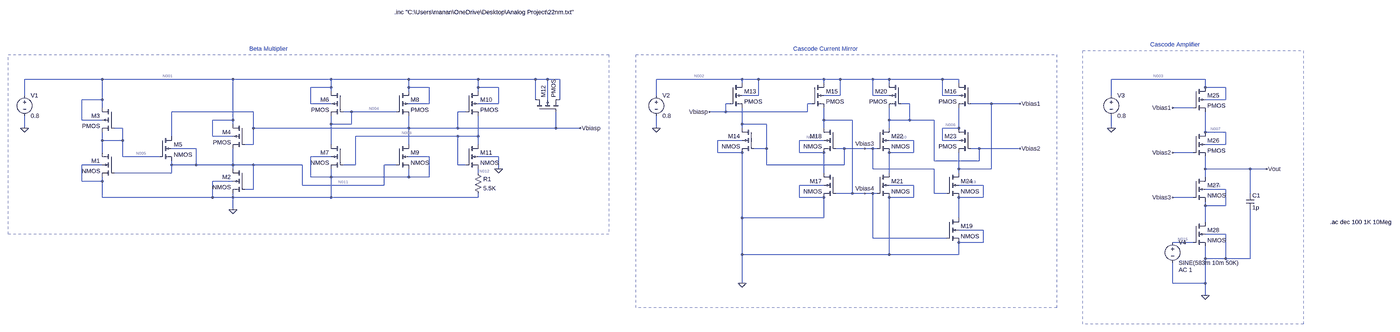
[diagram p0: schematic schematic 22nm.asc, whole sheet]
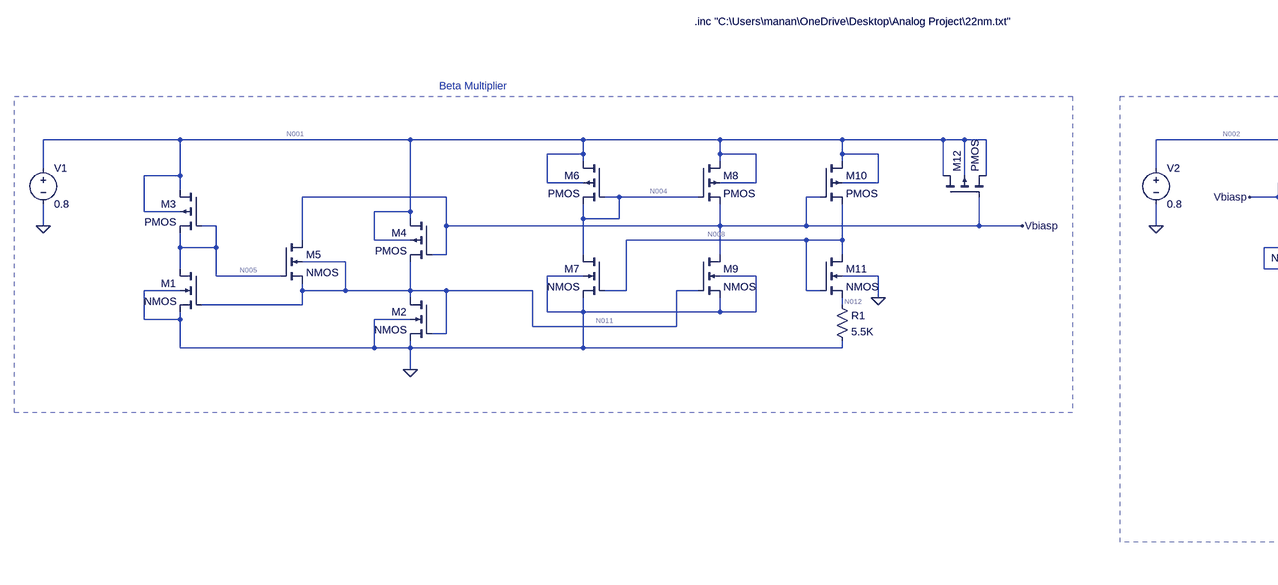
[diagram p1: schematic schematic 22nm.asc, part, row 1 of 1, column 1 of 2]
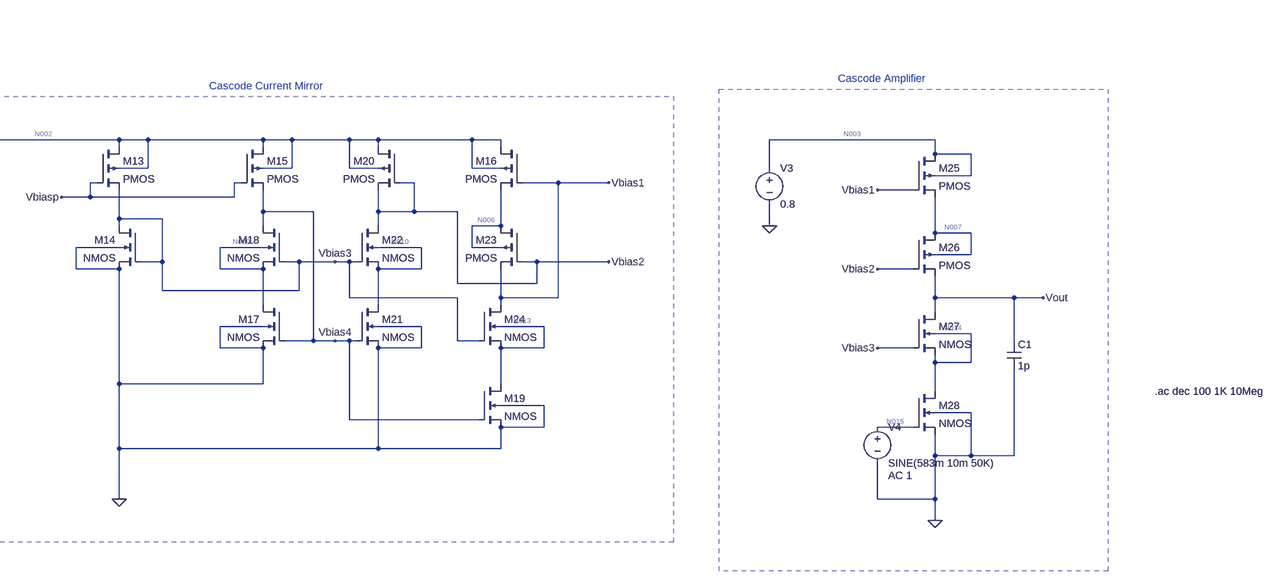
[diagram p2: schematic schematic 22nm.asc, part, row 1 of 1, column 2 of 2]
schematic 22nm.asc, the LTspice schematic file:
Version 4
SHEET 1 2888 964
WIRE -2528 0 -2832 0
WIRE -2016 0 -2528 0
WIRE -1632 0 -2016 0
WIRE -1328 0 -1632 0
WIRE -1056 0 -1328 0
WIRE -832 0 -1056 0
WIRE -784 0 -832 0
WIRE -736 0 -784 0
WIRE 224 0 -112 0
WIRE 288 0 224 0
WIRE 544 0 288 0
WIRE 608 0 544 0
WIRE 736 0 608 0
WIRE 800 0 736 0
WIRE 1008 0 800 0
WIRE 1072 0 1008 0
WIRE 2144 0 1776 0
WIRE 224 16 224 0
WIRE 544 16 544 0
WIRE 800 16 800 0
WIRE 1072 16 1072 0
WIRE -1632 32 -1632 0
WIRE -1632 32 -1712 32
WIRE -1328 32 -1328 0
WIRE -1248 32 -1328 32
WIRE -1056 32 -1056 0
WIRE -976 32 -1056 32
WIRE 2144 32 2144 0
WIRE 2224 32 2144 32
WIRE -1632 48 -1632 32
WIRE -1328 48 -1328 32
WIRE -1056 48 -1056 32
WIRE -2832 64 -2832 0
WIRE -112 64 -112 0
WIRE 288 64 288 0
WIRE 288 64 224 64
WIRE 608 64 608 0
WIRE 608 64 544 64
WIRE 736 64 736 0
WIRE 800 64 736 64
WIRE 1008 64 1008 0
WIRE 1072 64 1008 64
WIRE 1776 64 1776 0
WIRE -2528 80 -2528 0
WIRE -2528 80 -2608 80
WIRE -832 80 -832 0
WIRE -784 80 -784 0
WIRE -736 80 -736 0
WIRE 2224 80 2224 32
WIRE 2224 80 2144 80
WIRE -1712 96 -1712 32
WIRE -1632 96 -1712 96
WIRE -1248 96 -1248 32
WIRE -1248 96 -1328 96
WIRE -976 96 -976 32
WIRE -976 96 -1056 96
WIRE 176 96 160 96
WIRE 496 96 480 96
WIRE 880 96 848 96
WIRE 1200 96 1120 96
WIRE 1312 96 1200 96
WIRE -2528 112 -2528 80
WIRE 2096 112 2016 112
WIRE -1936 128 -2256 128
WIRE -1552 128 -1584 128
WIRE -1376 128 -1552 128
WIRE -1104 128 -1136 128
WIRE 160 128 160 96
WIRE 160 128 96 128
WIRE 480 128 480 96
WIRE 480 128 160 128
WIRE -2608 160 -2608 80
WIRE -2528 160 -2608 160
WIRE -2016 160 -2016 0
WIRE -2016 160 -2096 160
WIRE 544 160 544 112
WIRE 656 160 544 160
WIRE 800 160 800 112
WIRE 880 160 880 96
WIRE 880 160 800 160
WIRE 976 160 880 160
WIRE -2016 176 -2016 160
WIRE -1632 176 -1632 144
WIRE -1552 176 -1552 128
WIRE -1552 176 -1632 176
WIRE 224 176 224 112
WIRE 320 176 224 176
WIRE -2832 192 -2832 144
WIRE -2448 192 -2480 192
WIRE -1936 192 -1936 128
WIRE -1328 192 -1328 144
WIRE -1328 192 -1936 192
WIRE -1136 192 -1136 128
WIRE -1136 192 -1328 192
WIRE -752 192 -752 128
WIRE -752 192 -1136 192
WIRE -656 192 -752 192
WIRE -112 192 -112 144
WIRE 224 192 224 176
WIRE 544 192 544 160
WIRE 800 192 800 160
WIRE 1072 192 1072 112
WIRE 1072 192 1008 192
WIRE 1776 192 1776 144
WIRE 2144 208 2144 128
WIRE 2224 208 2144 208
WIRE -2256 224 -2256 128
WIRE -2096 224 -2096 160
WIRE -2016 224 -2096 224
WIRE -1136 224 -1536 224
WIRE -1056 224 -1056 144
WIRE -1056 224 -1136 224
WIRE -2528 240 -2528 208
WIRE -2448 240 -2448 192
WIRE -2448 240 -2528 240
WIRE 224 240 128 240
WIRE 544 240 448 240
WIRE 896 240 800 240
WIRE 1008 240 1008 192
WIRE 1072 240 1008 240
WIRE -1936 256 -1936 192
WIRE -1936 256 -1968 256
WIRE -1632 256 -1632 176
WIRE -1328 256 -1328 192
WIRE -1056 256 -1056 224
WIRE 2224 256 2224 208
WIRE 2224 256 2144 256
WIRE -2160 272 -2256 272
WIRE 320 272 320 176
WIRE 320 272 272 272
WIRE 624 272 592 272
WIRE 704 272 624 272
WIRE 736 272 704 272
WIRE 752 272 736 272
WIRE 1152 272 1120 272
WIRE 1312 272 1152 272
WIRE -2528 288 -2528 240
WIRE 128 288 128 240
WIRE 224 288 128 288
WIRE 448 288 448 240
WIRE 544 288 448 288
WIRE 896 288 896 240
WIRE 896 288 800 288
WIRE 2096 288 2016 288
WIRE -2448 304 -2448 240
WIRE -2304 304 -2448 304
WIRE -1632 304 -1712 304
WIRE -1248 304 -1328 304
WIRE -976 304 -1056 304
WIRE 976 320 976 160
WIRE 1152 320 1152 272
WIRE 1152 320 976 320
WIRE -2528 336 -2608 336
WIRE -2256 336 -2256 320
WIRE -2160 336 -2160 272
WIRE -2160 336 -2256 336
WIRE -2016 336 -2016 272
WIRE -2016 336 -2160 336
WIRE -1936 336 -2016 336
WIRE -1744 336 -1936 336
WIRE -1536 336 -1536 224
WIRE -1536 336 -1584 336
WIRE -1376 336 -1424 336
WIRE -1136 336 -1136 224
WIRE -1104 336 -1136 336
WIRE 320 336 320 272
WIRE 624 336 624 272
WIRE 624 336 320 336
WIRE -2016 352 -2016 336
WIRE -976 352 -976 304
WIRE 736 352 736 272
WIRE 976 352 736 352
WIRE 1072 352 1072 288
WIRE 1200 352 1200 96
WIRE 1200 352 1072 352
WIRE 2144 352 2144 304
WIRE 2320 352 2144 352
WIRE 2384 352 2320 352
WIRE -2256 368 -2256 336
WIRE -2256 368 -2480 368
WIRE -1056 368 -1056 352
WIRE 544 368 544 288
WIRE 800 368 800 288
WIRE 1072 368 1072 352
WIRE -1712 384 -1712 304
WIRE -1632 384 -1632 352
WIRE -1632 384 -1712 384
WIRE -1328 384 -1328 352
WIRE -1328 384 -1632 384
WIRE -1248 384 -1248 304
WIRE -1248 384 -1328 384
WIRE 2144 384 2144 352
WIRE -2608 400 -2608 336
WIRE -2528 400 -2528 384
WIRE -2528 400 -2608 400
WIRE -2016 400 -2096 400
WIRE -1744 416 -1744 336
WIRE -1424 416 -1424 336
WIRE -1424 416 -1744 416
WIRE 544 416 448 416
WIRE 896 416 800 416
WIRE 1168 416 1072 416
WIRE -1936 432 -1936 336
WIRE -1936 432 -1968 432
WIRE 2224 432 2144 432
WIRE 656 448 656 160
WIRE 656 448 592 448
WIRE 704 448 656 448
WIRE 736 448 704 448
WIRE 752 448 736 448
WIRE 976 448 976 352
WIRE 1024 448 976 448
WIRE 2320 448 2320 352
WIRE -2528 464 -2528 400
WIRE -2096 464 -2096 400
WIRE -2096 464 -2528 464
WIRE -2016 464 -2016 448
WIRE -2016 464 -2096 464
WIRE -1632 464 -1632 384
WIRE -1632 464 -2016 464
WIRE -1056 464 -1056 448
WIRE -1056 464 -1632 464
WIRE 448 464 448 416
WIRE 544 464 448 464
WIRE 896 464 896 416
WIRE 896 464 800 464
WIRE 1168 464 1168 416
WIRE 1168 464 1072 464
WIRE 2096 464 2016 464
WIRE 2144 496 2144 480
WIRE 2224 496 2224 432
WIRE 2224 496 2144 496
WIRE -2016 512 -2016 464
WIRE 224 544 224 288
WIRE 544 544 544 464
WIRE 544 544 224 544
WIRE 1072 544 1072 464
WIRE 2144 560 2144 496
WIRE 1168 592 1072 592
WIRE 2224 608 2144 608
WIRE 736 624 736 448
WIRE 1024 624 736 624
WIRE 1168 640 1168 592
WIRE 1168 640 1072 640
WIRE 2096 640 2016 640
WIRE 224 688 224 544
WIRE 800 688 800 464
WIRE 800 688 224 688
WIRE 1072 688 1072 640
WIRE 1072 688 800 688
WIRE 2144 704 2144 656
WIRE 2224 704 2224 608
WIRE 2224 704 2144 704
WIRE 2320 704 2320 512
WIRE 2320 704 2224 704
WIRE 224 800 224 688
WIRE 2016 800 2016 720
WIRE 2144 800 2144 704
WIRE 2144 800 2016 800
WIRE 2144 848 2144 800
FLAG -2832 192 0
FLAG -2016 512 0
FLAG -656 192 Vbiasp
FLAG -112 192 0
FLAG 224 800 0
FLAG 96 128 Vbiasp
FLAG 1312 96 Vbias1
FLAG 1312 272 Vbias2
FLAG 704 272 Vbias3
FLAG 704 448 Vbias4
FLAG 1776 192 0
FLAG 2144 848 0
FLAG 2016 112 Vbias1
FLAG 2016 288 Vbias2
FLAG 2016 464 Vbias3
FLAG 2384 352 Vout
FLAG -976 352 0
SYMBOL voltage -2832 48 R0
WINDOW 123 0 0 Left 0
WINDOW 39 0 0 Left 0
SYMATTR InstName V1
SYMATTR Value 0.8
SYMBOL nmos4 -2480 288 M0
SYMATTR InstName M1
SYMATTR Value2 l=44n w=220n
SYMBOL nmos4 -1968 352 M0
SYMATTR InstName M2
SYMATTR Value2 l=44n w=220n
SYMBOL pmos4 -2480 112 M0
SYMATTR InstName M3
SYMATTR Value2 l=440n w=220n
SYMBOL pmos4 -1968 176 M0
SYMATTR InstName M4
SYMATTR Value2 l=44n w=528n
SYMBOL nmos4 -2304 224 R0
SYMATTR InstName M5
SYMATTR Value2 l=44n w=88n
SYMBOL pmos4 -1584 48 M0
SYMATTR InstName M6
SYMATTR Value2 l=44n w=528n
SYMBOL nmos4 -1584 256 M0
SYMATTR InstName M7
SYMATTR Value2 l=44n w=220n
SYMBOL pmos4 -1376 48 R0
SYMATTR InstName M8
SYMATTR Value2 l=44n w=528n
SYMBOL nmos4 -1376 256 R0
SYMATTR InstName M9
SYMATTR Value2 l=44n w=220n
SYMBOL pmos4 -1104 48 R0
SYMATTR InstName M10
SYMATTR Value2 l=44n w=528n
SYMBOL nmos4 -1104 256 R0
SYMATTR InstName M11
SYMATTR Value2 l=44n w=660n
SYMBOL res -1072 352 R0
SYMATTR InstName R1
SYMATTR Value 5.5K
SYMBOL pmos4 -832 128 R270
SYMATTR InstName M12
SYMATTR Value2 l=1100n w=1100n
SYMBOL voltage -112 48 R0
WINDOW 123 0 0 Left 0
WINDOW 39 0 0 Left 0
SYMATTR InstName V2
SYMATTR Value 0.8
SYMBOL pmos4 176 16 R0
SYMATTR InstName M13
SYMATTR Value2 l=44n w=528n
SYMBOL nmos4 272 192 M0
SYMATTR InstName M14
SYMATTR Value2 l=44n w=110n
SYMBOL pmos4 496 16 R0
SYMATTR InstName M15
SYMATTR Value2 l=44n w=528n
SYMBOL pmos4 1120 16 M0
SYMATTR InstName M16
SYMATTR Value2 l=44n w=528n
SYMBOL nmos4 592 368 M0
SYMATTR InstName M17
SYMATTR Value2 l=44n w=220n
SYMBOL nmos4 592 192 M0
SYMATTR InstName M18
SYMATTR Value2 l=44n w=220n
SYMBOL nmos4 1024 544 R0
SYMATTR InstName M19
SYMATTR Value2 l=44n w=220n
SYMBOL pmos4 848 16 M0
SYMATTR InstName M20
SYMATTR Value2 l=110n w=440n
SYMBOL nmos4 752 368 R0
SYMATTR InstName M21
SYMATTR Value2 l=44n w=220n
SYMBOL nmos4 752 192 R0
SYMATTR InstName M22
SYMATTR Value2 l=44n w=220n
SYMBOL pmos4 1120 192 M0
SYMATTR InstName M23
SYMATTR Value2 l=44n w=528n
SYMBOL nmos4 1024 368 R0
SYMATTR InstName M24
SYMATTR Value2 l=44n w=220n
SYMBOL voltage 1776 48 R0
WINDOW 123 0 0 Left 0
WINDOW 39 0 0 Left 0
SYMATTR InstName V3
SYMATTR Value 0.8
SYMBOL pmos4 2096 32 R0
SYMATTR InstName M25
SYMATTR Value2 l=44n w=550n
SYMBOL pmos4 2096 208 R0
SYMATTR InstName M26
SYMATTR Value2 l=44n w=550n
SYMBOL nmos4 2096 384 R0
SYMATTR InstName M27
SYMATTR Value2 l=44n w=242n
SYMBOL nmos4 2096 560 R0
SYMATTR InstName M28
SYMATTR Value2 l=44n w=198n
SYMBOL cap 2304 448 R0
SYMATTR InstName C1
SYMATTR Value 1p
SYMBOL voltage 2016 624 R0
WINDOW 123 24 124 Left 2
WINDOW 39 0 0 Left 0
SYMATTR Value2 AC 1
SYMATTR InstName V4
SYMATTR Value SINE(583m 10m 50K)
TEXT -1384 -280 Left 2 !.inc "C:\\Users\\manan\\OneDrive\\Desktop\\Analog Project\\22nm.txt"
TEXT 2632 560 Left 2 !.ac dec 100 1K 10Meg
TEXT -1952 -120 Left 2 ;Beta Multiplier
TEXT 424 -120 Left 2 ;Cascode Current Mirror
TEXT 1928 -136 Left 2 ;Cascode Amplifier
RECTANGLE Normal -544 608 -2896 -96 2
RECTANGLE Normal 1456 896 -192 -96 2
RECTANGLE Normal 2528 960 1664 -112 2

The netlist it stands for:
* schematic 22nm.asc
V1 N001 0 0.8
M1 N005 N011 0 0 NMOS l=44n w=220n
M2 N011 N011 0 0 NMOS l=44n w=220n
M3 N001 N005 N005 N001 PMOS l=440n w=220n
M4 N001 Vbiasp N011 N001 PMOS l=44n w=528n
M5 Vbiasp N005 N011 N011 NMOS l=44n w=88n
M6 N001 N004 N004 N001 PMOS l=44n w=528n
M7 N004 N008 0 0 NMOS l=44n w=220n
M8 N001 N004 Vbiasp N001 PMOS l=44n w=528n
M9 Vbiasp N011 0 0 NMOS l=44n w=220n
M10 N001 Vbiasp N008 N001 PMOS l=44n w=528n
M11 N008 N008 N012 0 NMOS l=44n w=660n
R1 N012 0 5.5K
M12 N001 Vbiasp N001 N001 PMOS l=1100n w=1100n
V2 N002 0 0.8
M13 N002 Vbiasp Vbias3 N002 PMOS l=44n w=528n
M14 Vbias3 Vbias3 0 0 NMOS l=44n w=110n
M15 N002 Vbiasp Vbias4 N002 PMOS l=44n w=528n
M16 N002 Vbias1 N006 N002 PMOS l=44n w=528n
M17 N009 Vbias4 0 0 NMOS l=44n w=220n
M18 Vbias4 Vbias3 N009 N009 NMOS l=44n w=220n
M19 N013 Vbias4 0 0 NMOS l=44n w=220n
M20 N002 Vbias2 Vbias2 N002 PMOS l=110n w=440n
M21 N010 Vbias4 0 0 NMOS l=44n w=220n
M22 Vbias2 Vbias3 N010 N010 NMOS l=44n w=220n
M23 N006 Vbias2 Vbias1 N006 PMOS l=44n w=528n
M24 Vbias1 Vbias3 N013 N013 NMOS l=44n w=220n
V3 N003 0 0.8
M25 N003 Vbias1 N007 N003 PMOS l=44n w=550n
M26 N007 Vbias2 Vout N007 PMOS l=44n w=550n
M27 Vout Vbias3 N014 N014 NMOS l=44n w=242n
M28 N014 N015 0 0 NMOS l=44n w=198n
C1 Vout 0 1p
V4 N015 0 SINE(583m 10m 50K) AC 1
.model NMOS NMOS
.model PMOS PMOS
.lib standard.mos
.inc "C:\Users\manan\OneDrive\Desktop\Analog Project\22nm.txt"
.ac dec 100 1K 10Meg
* Beta Multiplier
* Cascode Current Mirror
* Cascode Amplifier
.backanno
.end

* Results of the author's LTspice run, read from the files saved beside the schematic
* Operating Point, zero values left out:
*   V(n001) = 800 mV
*   V(n005) = 14.68 mV
*   V(n011) = 539.9 mV
*   V(vbiasp) = 248.5 mV
*   V(n004) = 265.7 mV
*   V(n008) = 538.9 mV
*   V(n012) = 52.7 mV
*   V(n002) = 800 mV
*   V(vbias3) = 591.9 mV
*   V(vbias4) = 584.5 mV
*   V(vbias1) = 244.3 mV
*   V(n006) = 677.3 mV
*   V(n009) = 53.52 mV
*   V(n013) = 49.05 mV
*   V(vbias2) = 138.1 mV
*   V(n010) = 44.94 mV
*   V(n003) = 800 mV
*   V(n007) = 684.1 mV
*   V(vout) = 481.5 mV
*   V(n014) = 60.18 mV
*   V(n015) = 583 mV
*   Id(M1) = 2.042 µA
*   Ig(M1) = 18.23 pA
*   Is(M1) = -2.042 µA
*   Id(M2) = 9.576 µA
*   Ig(M2) = 13.67 pA
*   Is(M2) = -9.576 µA
*   Id(M5) = -781.3 pA
*   Ig(M5) = -6.567 pA
*   Ib(M5) = 781.7 pA
*   Is(M5) = 6.164 pA
*   Id(M7) = 8.516 µA
*   Ig(M7) = 13.83 pA
*   Is(M7) = -8.516 µA
*   Id(M9) = 8.584 µA
*   Ig(M9) = 14.17 pA
*   Is(M9) = -8.584 µA
*   Id(M11) = 9.582 µA
*   Ig(M11) = 16.33 pA
*   Is(M11) = -9.582 µA
*   Id(M14) = 9.282 µA
*   Ig(M14) = 13.69 pA
*   Is(M14) = -9.282 µA
*   Id(M17) = 9.328 µA
*   Ig(M17) = 31.15 pA
*   Is(M17) = -9.328 µA
*   Id(M18) = 9.328 µA
*   Ig(M18) = 13.34 pA
*   Is(M18) = -9.328 µA
*   Id(M19) = 8.751 µA
*   Ig(M19) = 31.32 pA
*   Is(M19) = -8.751 µA
*   Id(M21) = 8.187 µA
*   Ig(M21) = 31.48 pA
*   Is(M21) = -8.187 µA
*   Id(M22) = 8.187 µA
*   Ig(M22) = 17.96 pA
*   Is(M22) = -8.187 µA
*   Id(M24) = 8.751 µA
*   Ig(M24) = 15.34 pA
*   Is(M24) = -8.751 µA
*   Id(M27) = 8.937 µA
*   Ig(M27) = 13.2 pA
*   Is(M27) = -8.937 µA
*   Id(M28) = 8.937 µA
*   Ig(M28) = 27.16 pA
*   Is(M28) = -8.937 µA
*   Id(M3) = 2.042 µA
*   Ig(M3) = -58.17 pA
*   Ib(M3) = 58.88 pA
*   Is(M3) = -2.042 µA
*   Id(M4) = 9.577 µA
*   Is(M4) = -9.577 µA
*   Id(M6) = 8.516 µA
*   Is(M6) = -8.516 µA
*   Id(M8) = 8.583 µA
*   Is(M8) = -8.583 µA
*   Id(M10) = 9.582 µA
*   Is(M10) = -9.582 µA
*   Ig(M12) = -10.78 pA
*   Ib(M12) = 10.67 pA
*   Id(M13) = 9.282 µA
*   Is(M13) = -9.282 µA
*   Id(M15) = 9.328 µA
*   Is(M15) = -9.328 µA
*   Id(M16) = 8.751 µA
*   Is(M16) = -8.751 µA
*   Id(M20) = 8.187 µA
*   Ig(M20) = -2.776 pA
*   Ib(M20) = 3.43 pA
*   Is(M20) = -8.187 µA
*   Id(M23) = 8.751 µA
*   Is(M23) = -8.751 µA
*   Id(M25) = 8.937 µA
*   Is(M25) = -8.937 µA
*   Id(M26) = 8.937 µA
*   Is(M26) = -8.937 µA
*   I(R1) = 9.582 µA
*   I(V1) = -38.3 µA
*   I(V2) = -35.55 µA
*   I(V3) = -8.937 µA
*   I(V4) = -27.16 pA
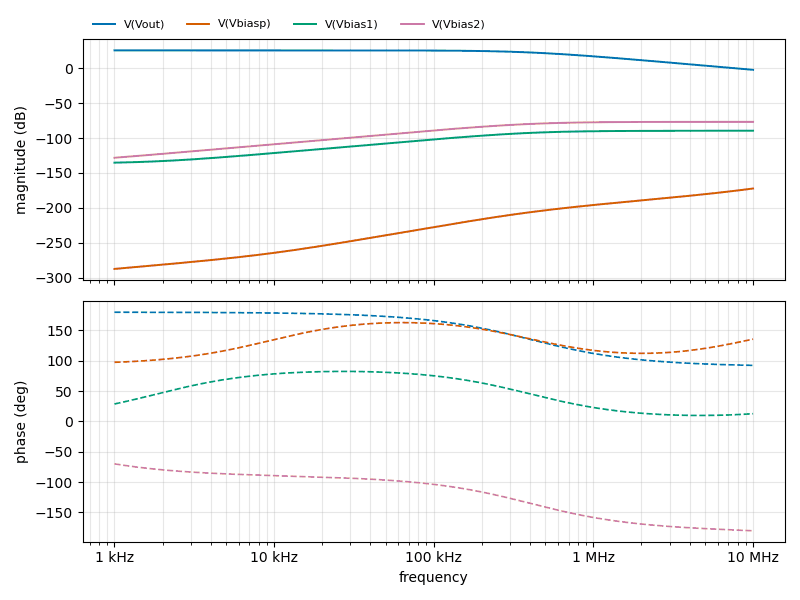
[diagram p3: AC Analysis of schematic 22nm.asc, plotted from the saved traces]
* AC Analysis, 1 run:
*   V(Vout): 25.94 dB at 1 kHz, -1.96 dB at 10 MHz, peak 25.94 dB at 1 kHz, 3 dB below the peak at 402.8 kHz
*   V(Vbiasp): -287.71 dB at 1 kHz, -172.31 dB at 10 MHz, peak -172.31 dB at 10 MHz, 3 dB below the peak at 7.871 MHz
*   V(Vbias1): -135.20 dB at 1 kHz, -89.30 dB at 10 MHz, peak -89.30 dB at 10 MHz, 3 dB below the peak at 415 kHz
*   V(Vbias2): -128.16 dB at 1 kHz, -76.60 dB at 10 MHz, peak -76.60 dB at 10 MHz, 3 dB below the peak at 403.2 kHz